# Altium project PCB_ASSProject.PrjPcb
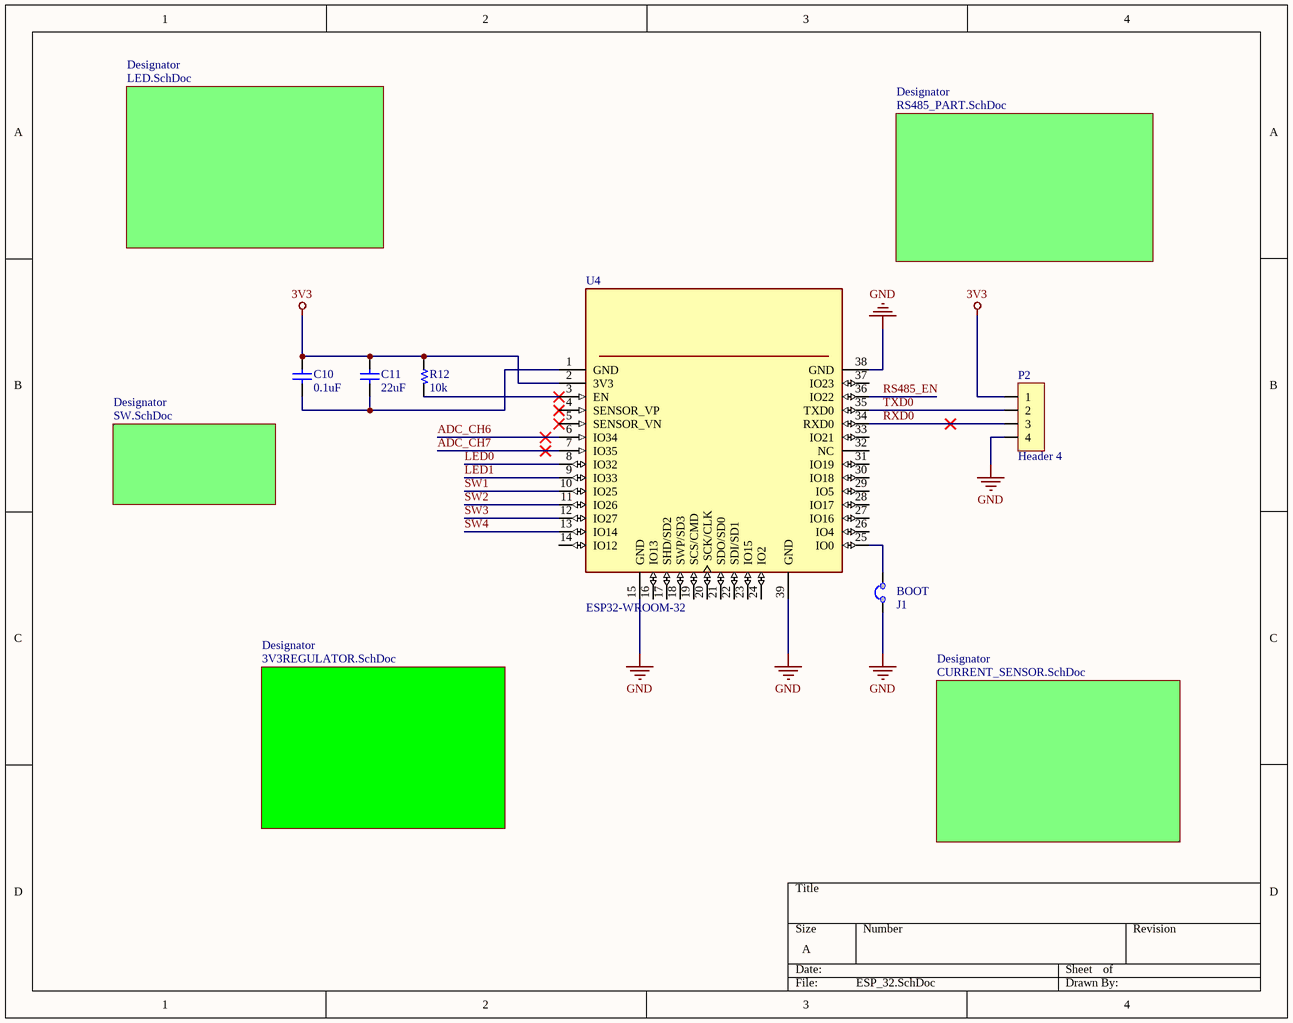
[diagram p0: ESP_32.SchDoc]
6 sheets, 60 parts. Net scope: global (net labels, ports and power ports of the same name join across sheets).
Board file: PCB1.PcbDoc
Sheets:
  ESP_32.SchDoc
    Designator = 3V3REGULATOR.SchDoc
    Designator = CURRENT_SENSOR.SchDoc
    Designator = RS485_PART.SchDoc
    Designator = LED.SchDoc
    Designator = SW.SchDoc

## Sheet ESP_32.SchDoc
size A

### Parts
C10  0.1uF  [C 1206]
C11  22uF  [C 1206]
J1  JUMP 2  [JUMP/2/Close]  (value not drawn)  (no BOM)
P2  Header 4  [HDR/Header/4]
R12  10k  [R 0603]
U4  ESP32-WROOM-32  [MODULE_ESP32-WROOM-32]

### Sub-sheets
Designator = 3V3REGULATOR.SchDoc: no entries
Designator = CURRENT_SENSOR.SchDoc: no entries
Designator = RS485_PART.SchDoc: no entries
Designator = LED.SchDoc: no entries
Designator = SW.SchDoc: no entries

### Nets
3V3: C10.1 C11.1 P2.1 R12.1 U4.2(3V3)
GND: J1.1 P2.4 U4.15(GND) U4.38(GND) U4.39(GND)
ADC_CH6: U4.6(IO34)
ADC_CH7: U4.7(IO35)  [project net 3V3/2]
LED0: U4.8(IO32)
LED1: U4.9(IO33)
RS485_EN: U4.36(IO22)
RXD0: P2.3 U4.34(RXD0)
SW1: U4.10(IO25)
SW2: U4.11(IO26)
SW3: U4.12(IO27)
SW4: U4.13(IO14)
TXD0: P2.2 U4.35(TXD0)
NetC10_2: C10.2 C11.2 U4.1(GND)
NetJ1_2: J1.2 U4.25(IO0)
NetR12_2: R12.2 U4.3(EN)

Not connected (* = marked no-connect by the designer): U4 4(SENSOR_VP)* 5(SENSOR_VN)* 14(IO12) 16(IO13) 17(SHD/SD2) 18(SWP/SD3) 19(SCS/CMD) 20(SCK/CLK) 21(SDO/SD0) 22(SDI/SD1) 23(IO15) 24(IO2) 26(IO4) 27(IO16) 28(IO17) 29(IO5) 30(IO18) 31(IO19) 32(NC) 33(IO21) 37(IO23)

### Notes on the sheet
- (near J1) BOOT

### Library data of the parts
C10 C11 = Capacitor NP: Capacitor non-pol
P2 = Header 4: Header, 4-Pin
R12 = Resistor
U4 = ESP32-WROOM-32: Bluetooth, WiFi 802.11b/g/n, Bluetooth v4.2 + EDR, Class 1, 2 and 3 Transceiver Module 2.4GHz ~ 2.5GHz Integrated, Trace Surface Mount; MF: Espressif Systems; MP: ESP32-WROOM-32D; Price: None; Package: Module Espressif Systems; Availability: Unavailable; SnapEDA_Link: https://www.snapeda.com/parts/ESP32-WROOM-32D/Espressif%20Systems/view-part/2768115/?ref=snap; Value: *

## Sheet 3V3REGULATOR.SchDoc
size A
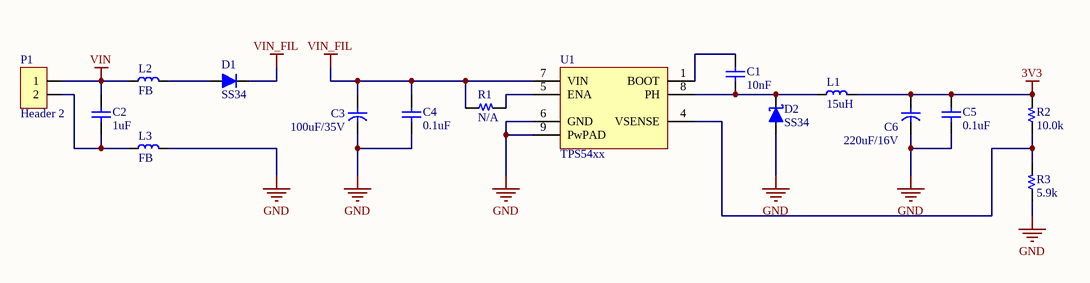
[diagram p1: 3V3REGULATOR.SchDoc]

### Parts
C1  10nF  [C 1206]
C2  1uF  [C 1206]
C3  100uF/35V  [C SMD ALU (D)]
C4  0.1uF  [C 1206]
C5  0.1uF  [C 1206]
C6  220uF/16V  [C SMD ALU (D)]
D1  SS34  [SOD123]
D2  SS34  [SOD123]
L1  15uH  [Inductor SMD 6.5x6.5x3.0]
L2  FB  [L 0805 (2012)]
L3  FB  [L 0805 (2012)]
P1  Header 2  [HDR/Terminal/2]
R1  N/A  [R 0603]
R2  10.0k  [R 0603]
R3  5.9k  [R 0603]
U1  TPS54xx  [SOIC-8 EP]

### Nets
3V3: C5.1 C6.1 L1.2 R2.2
GND: C3.2 C4.2 C5.2 C6.2 D2.1(A) L3.2 R3.1 U1.6(GND) U1.9(PwPAD)
VIN: C2.1 L2.1 P1.1
VIN_FIL: C3.1 C4.1 D1.2(K) R1.1 U1.7(VIN)
NetC1_1: C1.1 U1.1(BOOT)
NetC1_2: C1.2 D2.2(K) L1.1 U1.8(PH)
NetC2_2: C2.2 L3.1 P1.2
NetD1_1: D1.1(A) L2.2
NetR1_2: R1.2 U1.5(ENA)
NetR2_1: R2.1 R3.2 U1.4(VSENSE)

### Library data of the parts
C1 C2 C4 C5 = Capacitor NP: Capacitor non-pol
C3 C6 = Capacitor: Capacitor pol
D1 = Diode: Default Diode
D2 = Diode Schottky: Schottky Diode
L1-L3 = Inductor
P1 = Header 2: Header, 2-Pin
R1-R3 = Resistor
U1 = TPS54xx: 3/5A, Wide input range, Step-down SWIFT DC-DC Converter

## Sheet CURRENT_SENSOR.SchDoc
size A
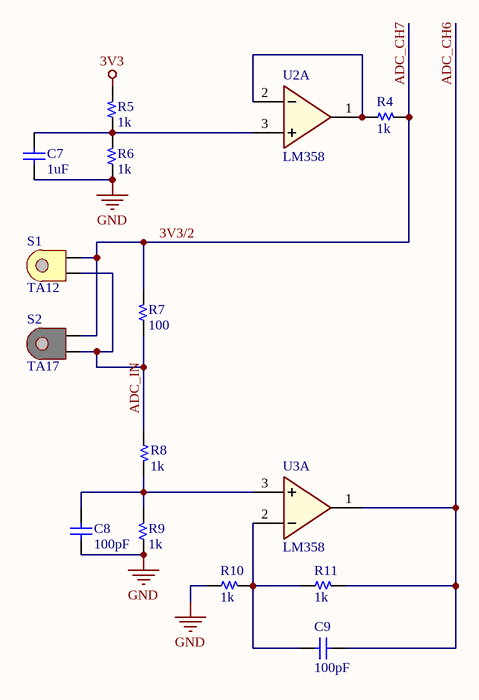
[diagram p2: CURRENT_SENSOR.SchDoc]

### Parts
C7  1uF  [C 1206]
C8  100pF  [C 1206]
C9  100pF  [C 1206]
R4  1k  [R 0603]
R5  1k  [R 0603]
R6  1k  [R 0603]
R7  100  [R 0603]
R8  1k  [R 0603]
R9  1k  [R 0603]
R10  1k  [R 0603]
R11  1k  [R 0603]
S1  TA12  [TA12]
S2  TA17  [TA17]
U2  LM358  [SOIC-8]  (part A of 2)
U3  LM358  [SOIC-8]  (part A of 2)

### Nets
3V3: R5.2
GND: C7.2 C8.2 R6.1 R9.1 R10.1 U2.4(GND) U3.4(GND)
VCC: U2.8(VCC) U3.8(VCC)
3V3/2: R4.2 R7.2 S1.1 S2.1  [also labelled ADC_CH7]
ADC_CH6: C9.2 R11.2 U3.1(OutA)
ADC_IN: R7.1 R8.1 S1.2 S2.2
NetC7_1: C7.1 R5.1 R6.2 U2.3(A+)
NetC8_1: C8.1 R8.2 R9.2 U3.3(A+)
NetC9_1: C9.1 R10.2 R11.1 U3.2(A-)
NetR4_1: R4.1 U2.1(OutA) U2.2(A-)

### Library data of the parts
C7-C9 = Capacitor NP: Capacitor non-pol
R4-R11 = Resistor
U2 U3 = LM358: Low Power Dual Operational Amplifiers

## Sheet RS485_PART.SchDoc
size A
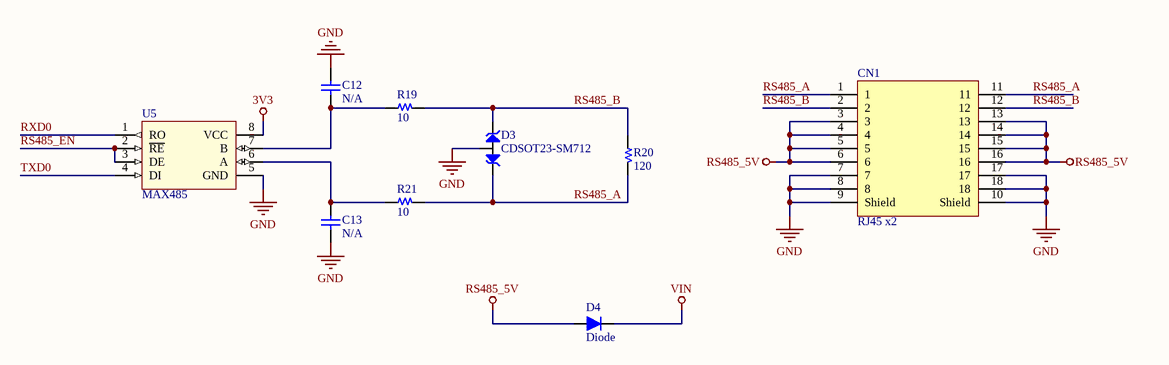
[diagram p3: RS485_PART.SchDoc]

### Parts
C12  N/A  [C 1206]
C13  N/A  [C 1206]
CN1  RJ45 x2  [CONN/RJ45/x2]
D3  CDSOT23-SM712  [SOT-23]
D4  Diode  [SOD123]
R19  10  [R 0603]
R20  120  [R 0603]
R21  10  [R 0603]
U5  MAX485  [SOIC-8]

### Nets
3V3: U5.8(VCC)
GND: C12.1 C13.2 CN1.7 CN1.8 CN1.9(Shield) CN1.10(Shield) CN1.17 CN1.18 D3.3(COM) U5.5(GND)
RS485_5V: CN1.3 CN1.4 CN1.5 CN1.6 CN1.13 CN1.14 CN1.15 CN1.16 D4.1(A)
VIN: D4.2(K)
RS485_A: CN1.1 CN1.11 D3.1(IO1) R20.2 R21.2
RS485_B: CN1.2 CN1.12 D3.2(IO2) R19.2 R20.1
RS485_EN: U5.2(~{RE}) U5.3(DE)
RXD0: U5.1(RO)
TXD0: U5.4(DI)
NetC12_2: C12.2 R19.1 U5.7(B)
NetC13_1: C13.1 R21.1 U5.6(A)

### Library data of the parts
C12 C13 = Capacitor NP: Capacitor non-pol
CN1 = CON RJ45 x2: Connector RJ45 X2
D3 = CDSOT23-SM712: TVS DIODE 7V/12V 14V/26V SOT23-3
D4 = Diode: Default Diode
R19-R21 = Resistor
U5 = MAX485: Low-Power, Slew-Rate-Limited  RS-485/RS-422 Transceivers

## Sheet LED.SchDoc
size A
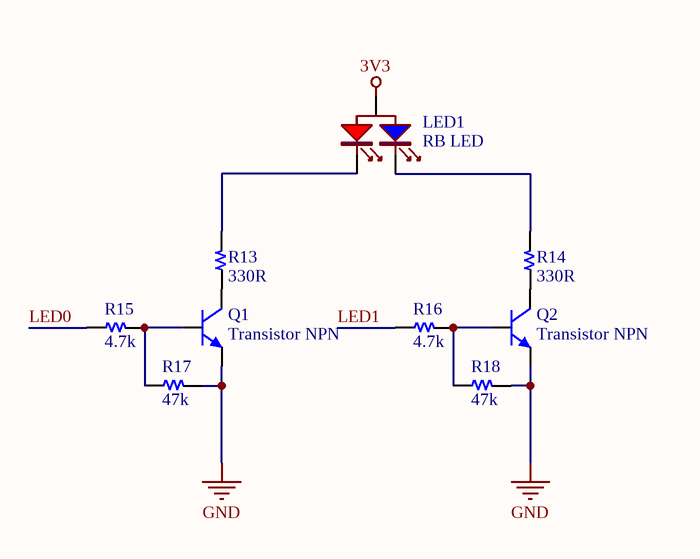
[diagram p4: LED.SchDoc]

### Parts
LED1  RB LED  [LED-BICOLOR-3MM]
Q1  Transistor NPN  [SOT-23]
Q2  Transistor NPN  [SOT-23]
R13  330R  [R 0603]
R14  330R  [R 0603]
R15  4.7k  [R 0603]
R16  4.7k  [R 0603]
R17  47k  [R 0603]
R18  47k  [R 0603]

### Nets
3V3: LED1.2(A)
GND: Q1.2(E) Q2.2(E) R17.2 R18.2
LED0: R15.1
LED1: R16.1
NetLED1_1: LED1.1(K1) R13.2
NetLED1_3: LED1.3(K2) R14.2
NetQ1_1: Q1.1(B) R15.2 R17.1
NetQ1_3: Q1.3(C) R13.1
NetQ2_1: Q2.1(B) R16.2 R18.1
NetQ2_3: Q2.3(C) R14.1

### Library data of the parts
LED1 = LED 2-color-A: Bicolor RB 3mm LED
Q1 Q2 = Transistor NPN: NPN Bipolar Transistor
R13-R18 = Resistor

## Sheet SW.SchDoc
size A
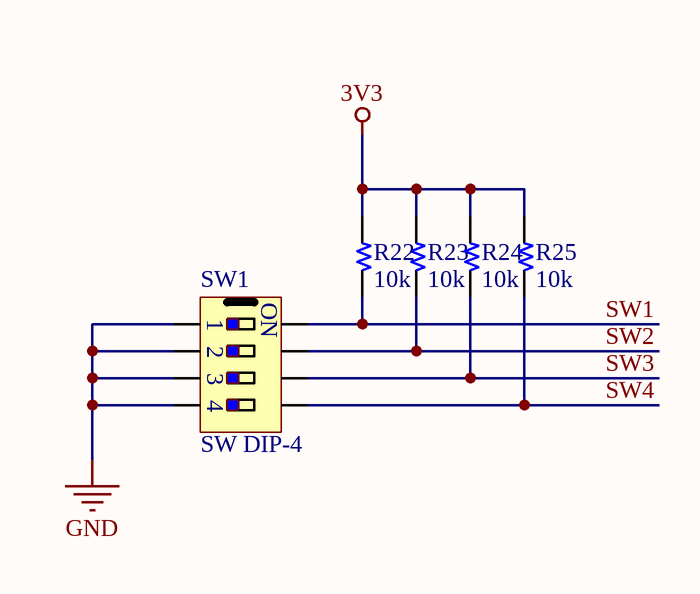
[diagram p5: SW.SchDoc]

### Parts
R22  10k  [R 0603]
R23  10k  [R 0603]
R24  10k  [R 0603]
R25  10k  [R 0603]
SW1  SW DIP-4  [SW/DIP4]

### Nets
3V3: R22.2 R23.2 R24.2 R25.2
GND: SW1.1 SW1.2 SW1.3 SW1.4
SW1: R22.1 SW1.8
SW2: R23.1 SW1.7
SW3: R24.1 SW1.6
SW4: R25.1 SW1.5

### Notes on the sheet
- (in symbol SW DIP-4) ON

### Library data of the parts
R22-R25 = Resistor

## Nets that join several sheets
3V3: ESP_32 (5 pins), 3V3REGULATOR (C5.1 C6.1 L1.2 R2.2), CURRENT_SENSOR (R5.2), RS485_PART (U5.8), LED (LED1.2), SW (R22.2 R23.2 R24.2 R25.2)
GND: ESP_32 (5 pins), 3V3REGULATOR (9 pins), CURRENT_SENSOR (7 pins), RS485_PART (10 pins), LED (Q1.2 Q2.2 R17.2 R18.2), SW (SW1.1 SW1.2 SW1.3 SW1.4)
VIN: 3V3REGULATOR (C2.1 L2.1 P1.1), RS485_PART (D4.2)
3V3/2: ESP_32 (U4.7), CURRENT_SENSOR (R4.2 R7.2 S1.1 S2.1)
ADC_CH6: ESP_32 (U4.6), CURRENT_SENSOR (C9.2 R11.2 U3.1)
LED0: ESP_32 (U4.8), LED (R15.1)
LED1: ESP_32 (U4.9), LED (R16.1)
RS485_EN: ESP_32 (U4.36), RS485_PART (U5.2 U5.3)
RXD0: ESP_32 (P2.3 U4.34), RS485_PART (U5.1)
SW1: ESP_32 (U4.10), SW (R22.1 SW1.8)
SW2: ESP_32 (U4.11), SW (R23.1 SW1.7)
SW3: ESP_32 (U4.12), SW (R24.1 SW1.6)
SW4: ESP_32 (U4.13), SW (R25.1 SW1.5)
TXD0: ESP_32 (P2.2 U4.35), RS485_PART (U5.4)